# EAGLE design CreeConnectedDriver (EAGLE 8.1.0)
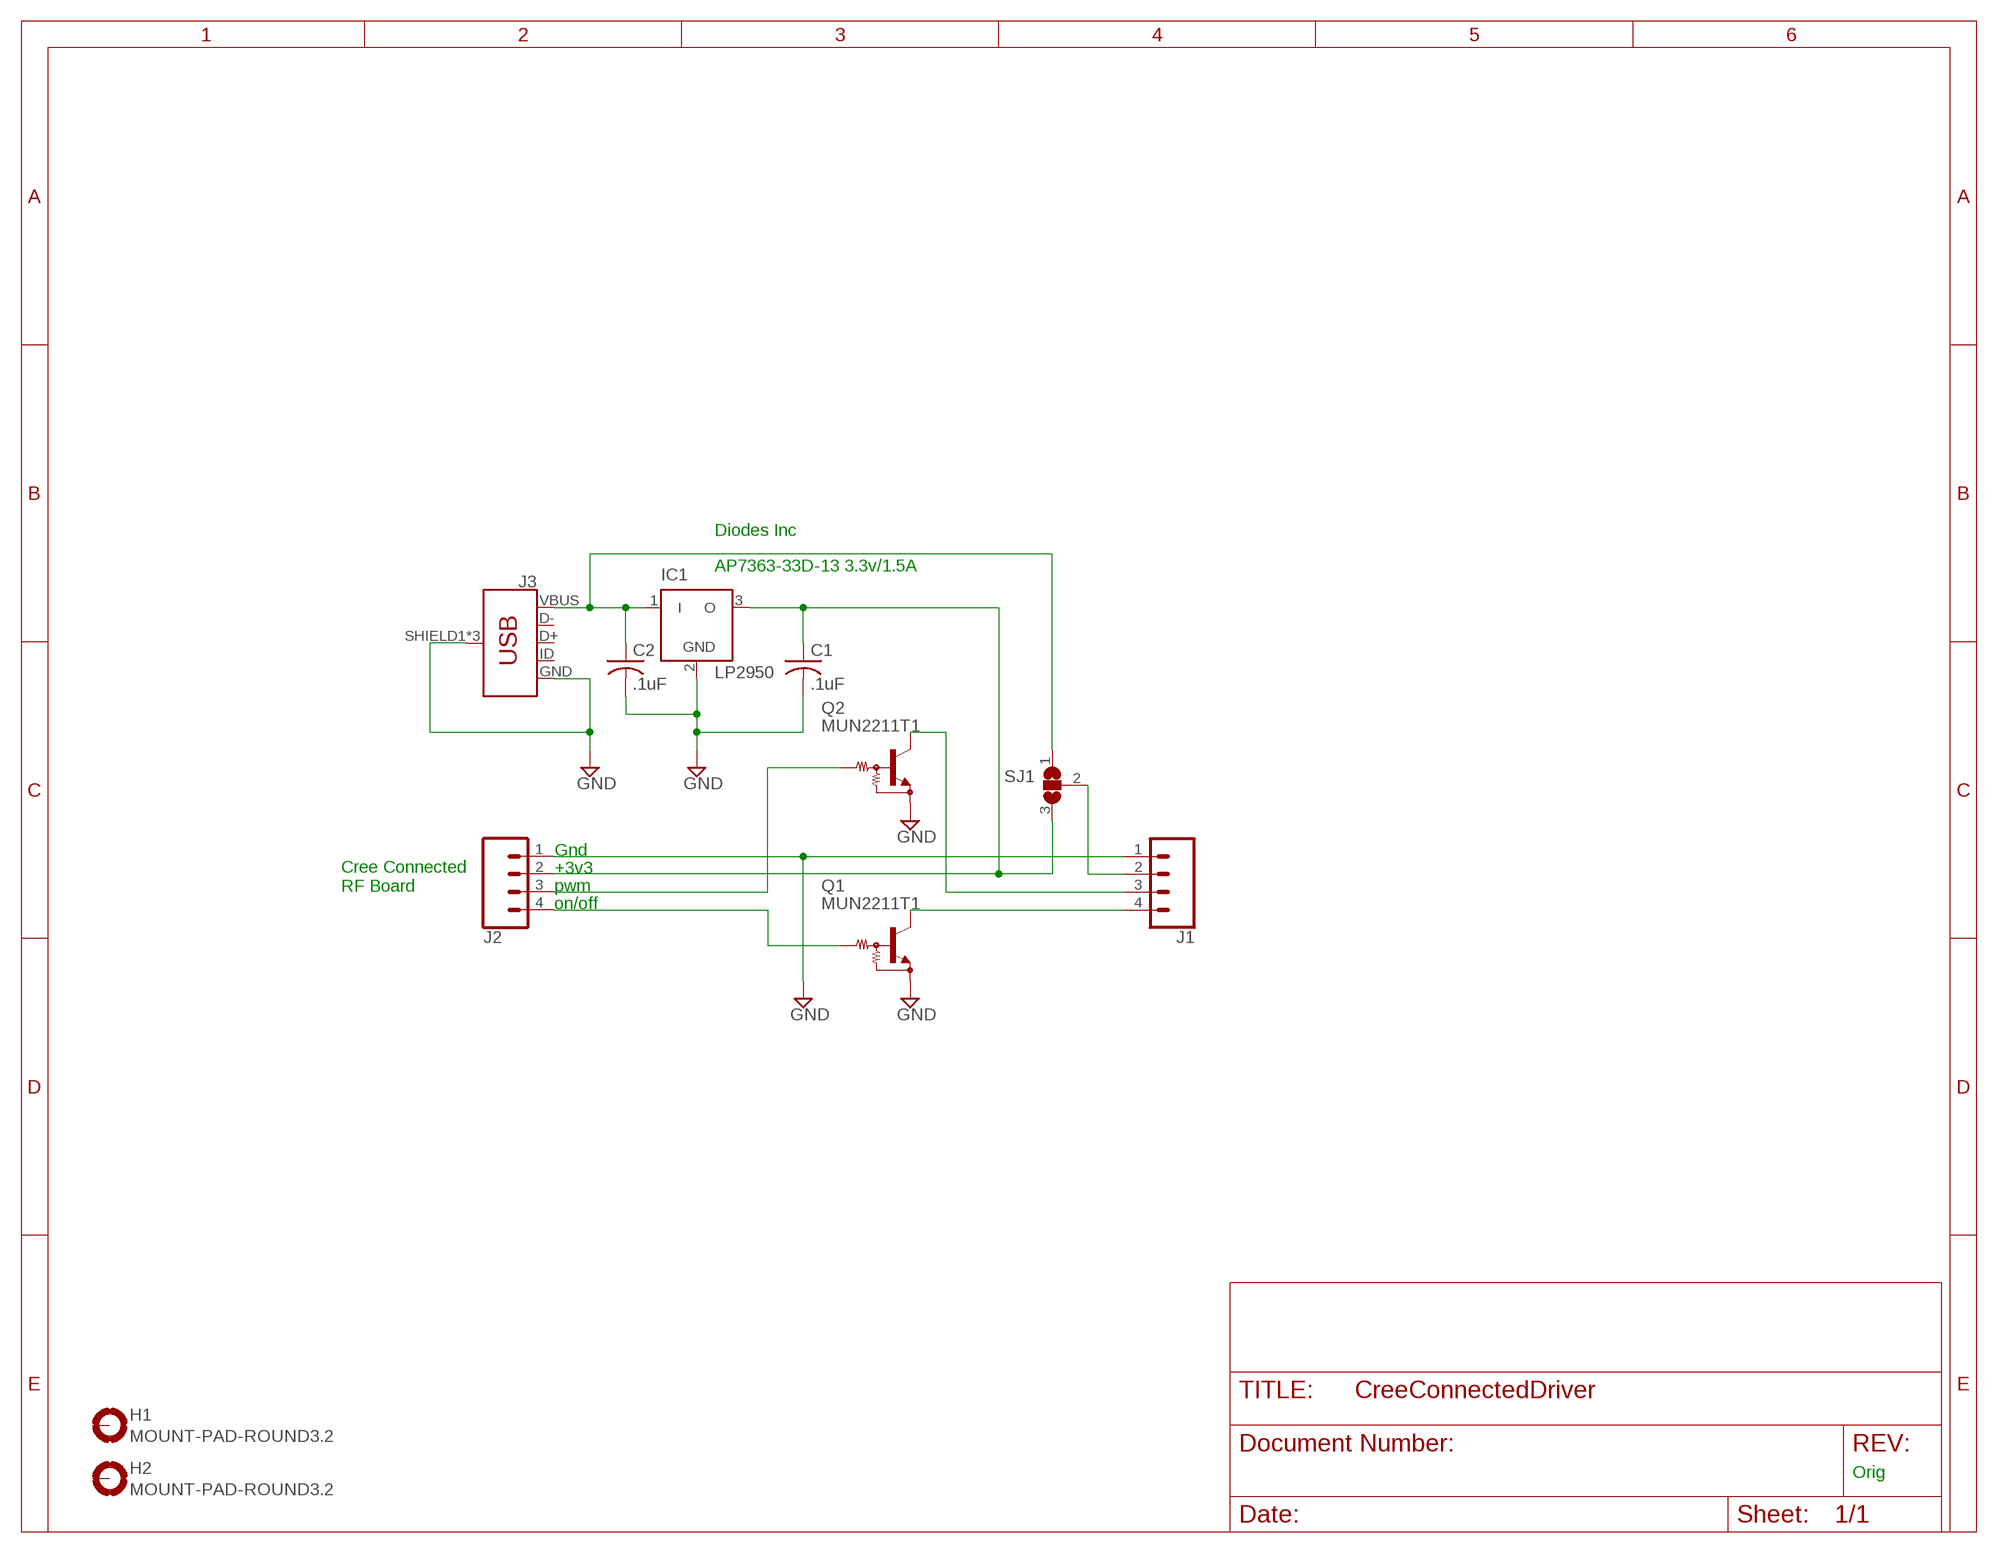
[diagram p0: schematic, sheet 1]

## Parts
C1  .1uF  C-USC1206  [C1206]
C2  .1uF  C-USC1206  [C1206]
H1  MOUNT-PAD-ROUND3.2  [3,2-PAD]
H2  MOUNT-PAD-ROUND3.2  [3,2-PAD]
IC1  LP2950  [DPACK]
J1  CONN_04JST-PTH-VERT  [JST-4-PTH-VERT]
J2  CONN_04JST-PTH-VERT  [JST-4-PTH-VERT]
J3  USB_MICRO-B_FEMALE-SMT  [USB-B-MICRO-SMD]
Q1  MUN2211T1  [SC59-BEC]
Q2  MUN2211T1  [SC59-BEC]
SJ1  SJ2W  [SJ_2]

## Nets
GND: C1.2 C2.2 IC1.2(GND) J1.1 J2.1 J3.GND J3.SHIELD1(SHIELD) J3.SHIELD2(SHIELD) J3.SHIELD3(SHIELD) Q1.E Q2.E
N$1: C1.1 IC1.3(O) J2.2 SJ1.3
N$2: J1.2 SJ1.2
N$3: J2.3 Q2.B
N$4: J2.4 Q1.B
N$5: J1.4 Q1.C
N$6: J1.3 Q2.C
N$7: C2.1 IC1.1(I) J3.VBUS SJ1.1
Unconnected: H1.B3,2(MOUNT) H2.B3,2(MOUNT) J3.D+ J3.D- J3.ID

## Notes on the sheet
- Diodes Inc
- AP7363-33D-13 3.3v/1.5A
- Gnd
- +3v3
- Cree Connected
  RF Board
- pwm
- on/off
- Orig

## Library data of the parts
C1 C2 = resistor:C-US: CAPACITOR, American symbol
H1 H2 = holes:MOUNT-PAD-ROUND: MOUNTING PAD, round
IC1 = linear:LP2950: 100 mA, Low Power Low Dropout Voltage Regulator Source: http://www.onsemi.com/pub/Collateral/LP2950-D.PDF
J1 J2 = SparkFun-Connectors:CONN_04: Multi connection point. Often used as Generic Header-pin footprint for 0.1 inch spaced/style header connections On any of the 0.1 inch spaced packages, you can populate with these: Break Away Headers - Straight <https://www.sparkfun.com/products/116> (PRT-00116) Break Away Male Headers - Right Angle <https://www.sparkfun.com/products/553> (PRT-00553) Female Headers <https://www.sparkfun.com/products/115> (PRT-00115) Break Away Headers - Machine Pin <https://www.sparkfun.com/products/117> (PRT-00117) Break Away Female Headers - Swiss Machine Pin <https://www.sparkfun.com/products/743> (PRT-00743) For SCREWTERMINALS and SPRING TERMINALS visit here: Screw Terimnals on SparkFun.com <https://www.sparkfun.com/search/results?term=Screw+Terminals> (5mm/3.5mm/2.54mm spacing) This device is also useful as a general connection point to wire up your design to another part of your project. Our various solder wires solder well into these plated through hole pads. Hook-Up Wire - Assortment (Stranded, 22 AWG) <https://www.sparkfun.com/products/11375> (PRT-11375) Hook-Up Wire - Assortment (Solid Core, 22 AWG) <https://www.sparkfun.com/products/11367> (PRT-11367) View the entire wire category on our website here <https://www.sparkfun.com/categories/141> Special notes: Molex polarized connector foot print use with SKU : PRT-08231 with associated crimp pins and housings. 1MM SMD Version SKU: PRT-10208; PROD_ID: CONN-13251
J3 = SparkFun-Connectors:USB_MICRO-B: USB Type Micro-B Connector Male/female and PTH/SMT variants SparkFun Products: SparkFun microB USB Breakout <https://www.sparkfun.com/products/12035> SparkFun USB microB Plug Breakout <https://www.sparkfun.com/products/10031> SparkFun ESP8266 Thing <https://www.sparkfun.com/products/13231>; PROD_ID: CONN-11752
Q1 Q2 = transistor-npn:MUN2211*: NPN Bias Resistor Transistor
SJ1 = jumper:SJ2W: SMD solder JUMPER

## Board
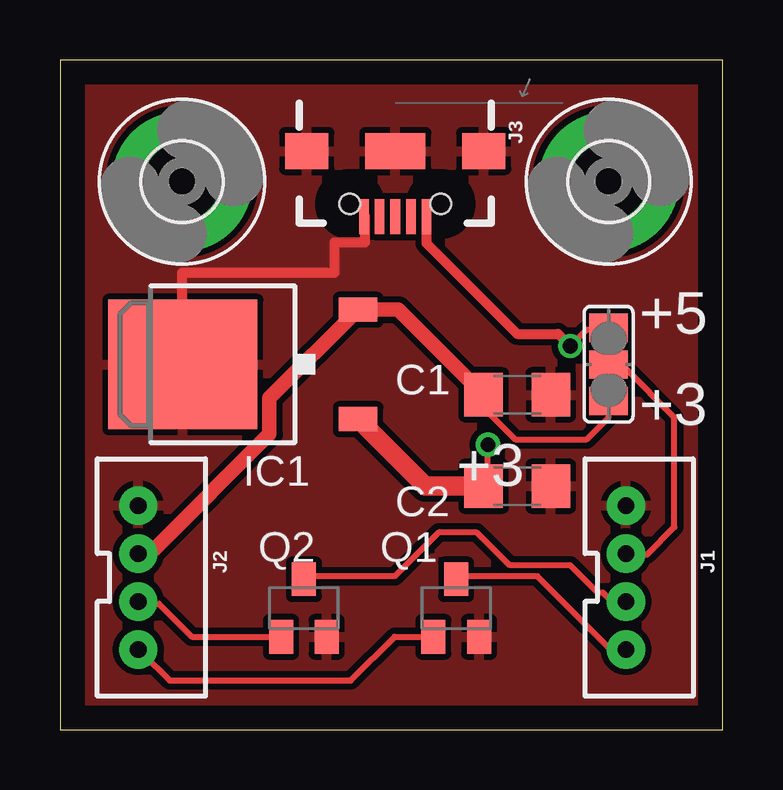
[diagram p1: board, top side]
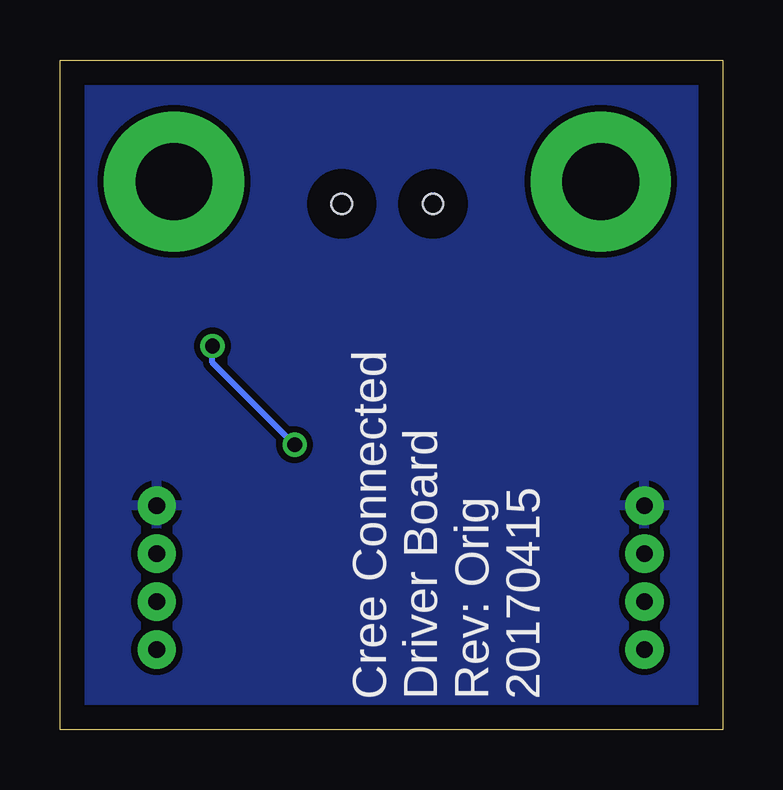
[diagram p2: board, bottom side, seen from below]

Size 27.61 x 27.93 mm. Coordinates in mm from the lower left corner, seen from the top.
Outline: 0,0 27.61,0 27.61,27.93 0,27.93 0,0
Copper layers (1*16): Top 0.035mm / dielectric 1.5mm / Bottom 0.035mm
Design rules "default": minimum track width 10mil, minimum drill 24mil, track to track 8mil, track to pad 8mil, pad to pad 8mil, via to via 8mil, smd to smd 8mil, copper to edge 40mil, drill to drill 8mil, minimum pad ring 10mil, minimum via ring 8mil, stop-mask expansion 4mil, vias tented up to drill 0mil, thermal gap 10mil

### Footprints (pad centres in the part's own frame; a part is rotated, then mirrored left to right if it is on the bottom)
C1206 = smd 1.6 x 1.8: 1 -1.4,0; 2 1.4,0
3,2-PAD = drill 3.2 pad 5.842: B3,2 0,0
DPACK = smd 1 x 1.6: 1 -2.28,-4.8; 3 2.28,-4.8 | smd 5.4 x 6.2: 2 0,2.5
JST-4-PTH-VERT = drill 0.7 pad 1.6: 1 -3,-0.55; 2 -1,-0.55; 3 1,-0.55; 4 3,-0.55
USB-B-MICRO-SMD = smd 1.45 x 0.4: D+ 2.725,0; D- 2.725,0.65; GND 2.725,-1.3; ID 2.725,-0.65; VBUS 2.725,1.3 | smd 1.5 x 1.8: SHIELD1 0,3.685; SHIELD2 0,-3.685 | smd 1.5 x 2.5: SHIELD3 0,0 | hole 0.85: 2.2,1.9; 2.2,-1.9
SC59-BEC = smd 1 x 1.4: B -0.95,-1.2; C 0,1.2; E 0.95,-1.2
SJ_2 = smd 1.168 x 1.6: 1 -1.524,0; 2 0,0; 3 1.524,0

### Placement (x,y rotation side)
C1  19.05,13.97 0 top
C2  19.05,10.16 0 top
H1  5.08,22.86 0 top
H2  22.86,22.86 0 top
IC1  7.62,15.24 90 top
J1  24.13,6.35 270 top
J2  3.81,6.35 270 top
J3  13.97,24.13 270 top
Q1  16.51,5.08 0 top
Q2  10.16,5.08 0 top
SJ1  22.86,15.24 270 top

### Tracks (layer width: path | path; a pad name or v marks a point on that pad's centre or on a via)
GND
  Top 0.406: J3.GND 12.7,21.41 12.7,20.32 11.43,20.32 11.43,19.05 5.08,19.05 5.08,17.78 5.12,17.78 IC1.2
  pour Bottom (isolate 0.254): 0,27.94 0,0 27.94,0 27.94,27.94
  pour Top (isolate 0.254): 0,27.94 0,0 27.94,0 27.94,27.94
N$1
  Top 0.254: 13.03,17.6 12.57,17.6 IC1.3 13.03,17.6 | 17.37,14.4 17.6,14.17 C1.1 17.83,13.95 17.83,13.26 18.97,12.12 21.95,12.12 22.86,13.03 SJ1.3 | 13.03,17.6 13.03,17.14
  Top 0.61: J2.2 3.41,7.5 3.9,7.5 8.73,12.33 8.73,13.83 IC1.3 14.1,17.52 C1.1
N$2
  Top 0.254: SJ1.2 22.86,15.09 23.55,15.09 25.6,13.03 25.6,8.46 24.46,7.32 23.77,7.32 J1.2
N$3
  Top 0.254: Q2.B 9.14,3.89 5.49,3.89 4.12,5.26 3.43,5.26 J2.3
N$4
  Top 0.254: Q1.B 15.54,3.89 13.95,3.89 12.12,2.06 4.57,2.06 3.43,3.2 J2.4
N$5
  Top 0.254: Q1.C 16.69,6.4 19.89,6.4 22.86,3.43 23.55,3.43 J1.4
N$6
  Top 0.254: Q2.C 10.29,6.4 13.95,6.4 15.77,8.23 17.37,8.23 18.75,6.86 21.26,6.86 22.4,5.71 22.63,5.71 22.86,5.49 23.55,5.49 J1.3
N$7  (via drill 0.61)
  Top 0.254: 17.37,10.52 17.6,10.29 C2.1 17.83,10.29 v17.83,11.89 | IC1.1 12.57,13.03 | v21.26,16 21.95,16.69 22.86,16.69 SJ1.1
  Top 0.406: J3.VBUS 15.27,20.29 19.05,16.51 20.75,16.51 v21.26,16
  Top 0.813: C2.1 15.22,10.16 IC1.1
  Bottom 0.254: v21.26,16 21.26,15.32 v17.83,11.89

### Text on the board
tSilk: +3 | +3
_tsilk: +5
_bsilk: Cree Connected / Driver Board / Rev: Orig / 20170415